# EAGLE schematic SL869-GL868-Rx (EAGLE 6.5.0)
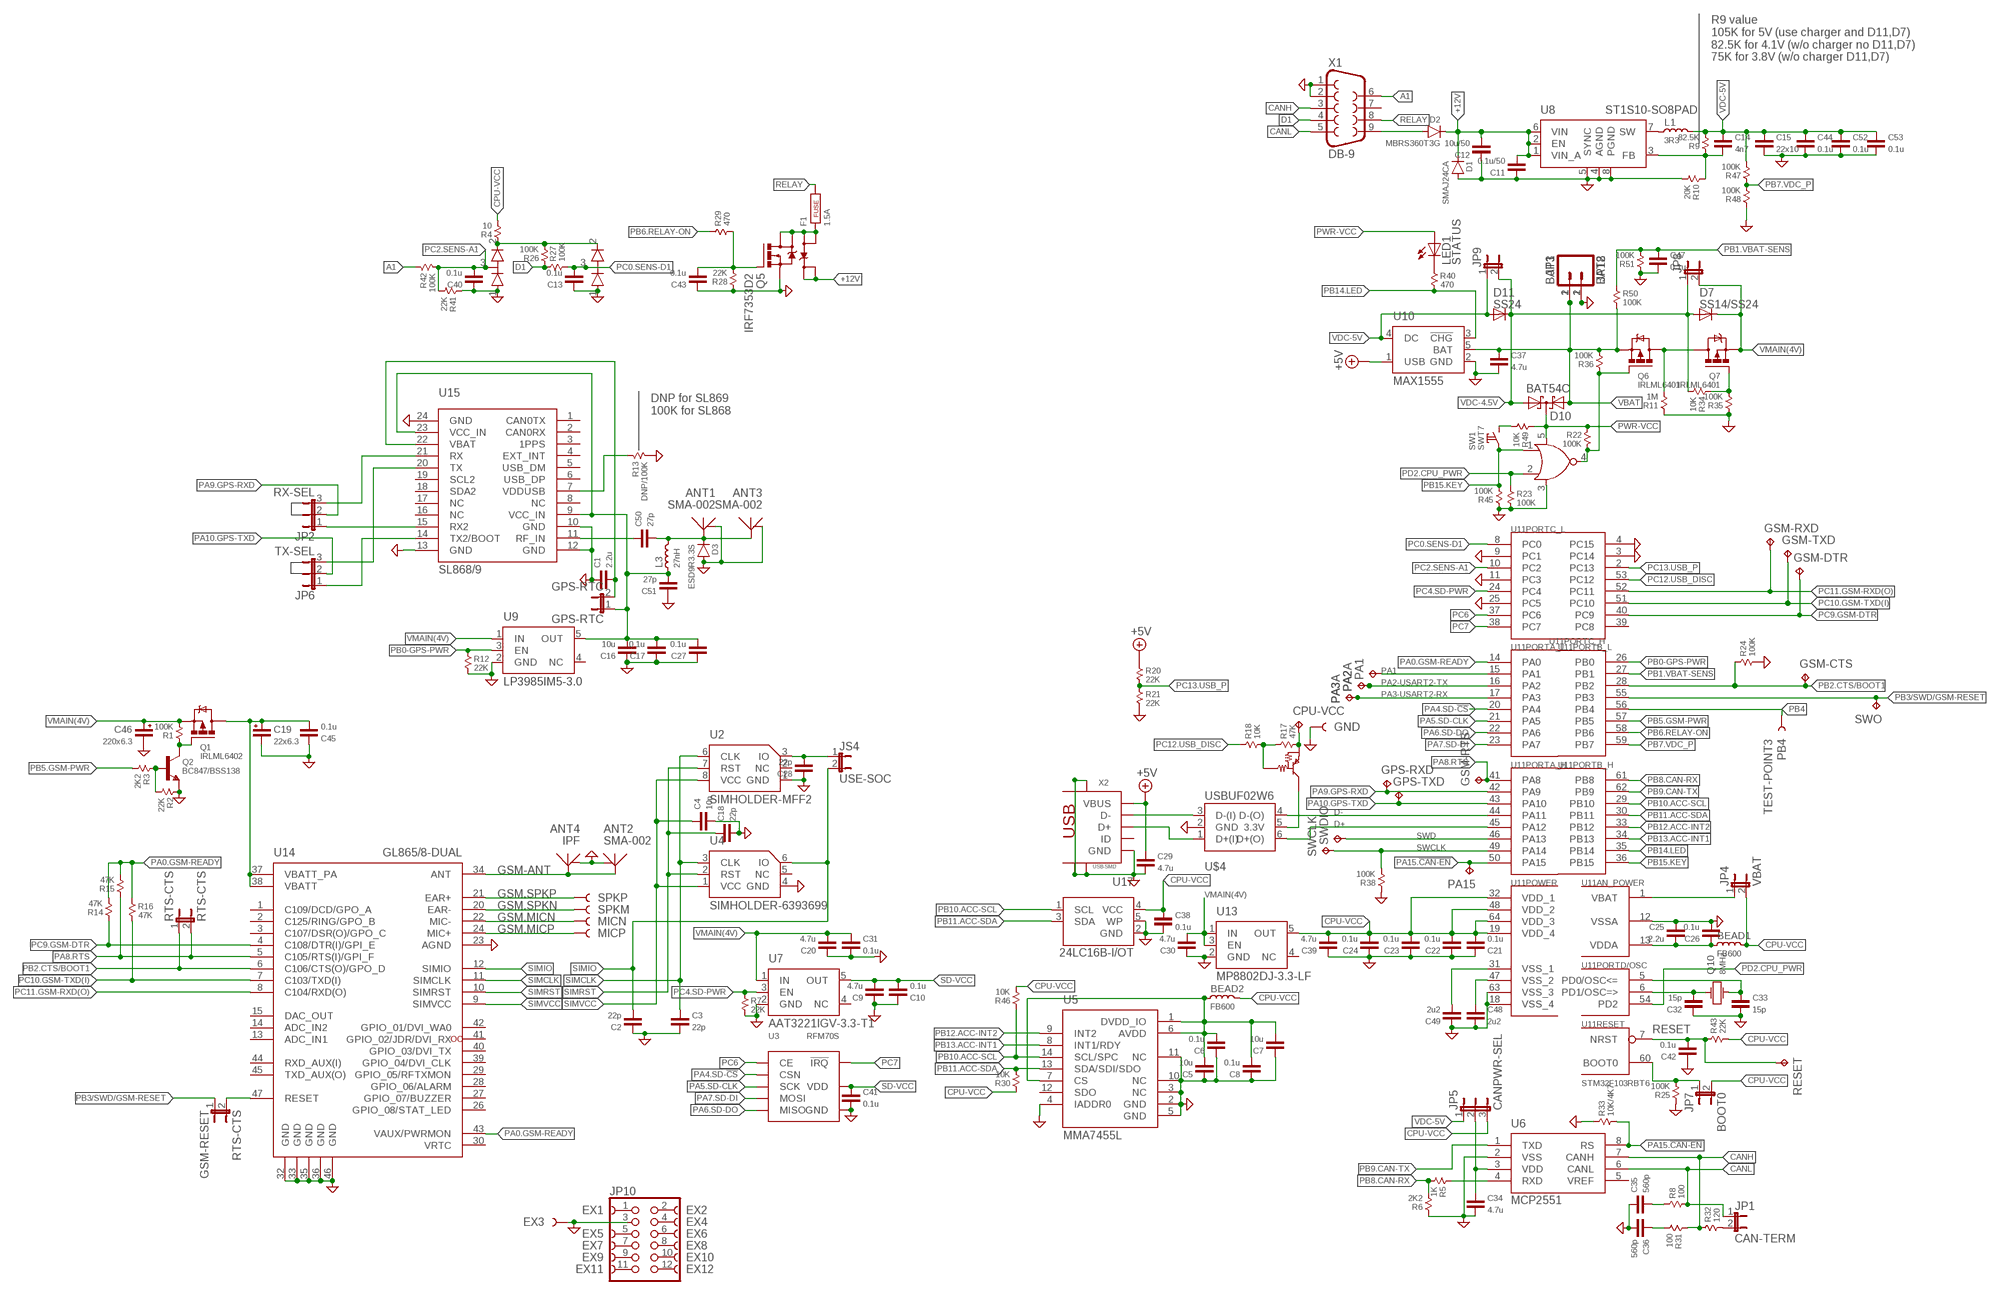
[diagram p0: schematic, sheet 1]

## Parts
ANT1  SMA-002  ANTENNA-SMA-002  [SMA-002]
ANT2  SMA-002  ANTENNA-SMA-002  [SMA-002]
ANT3  SMA-002  ANTENNA-IPF  [MM9329]
ANT4  IPF  ANTENNA-IPF  [MM9329]
BEAD1  FB600  INDUCTOR-0603  [0603]
BEAD2  FB600  INDUCTOR-0603  [0603]
C1  2.2u  CAP-0603  [0603]
C2  22p  CAP-0603  [0603]
C3  22p  CAP-0603  [0603]
C4  10n  CAP-0603  [0603]
C5  10u  CAP-0603  [0603]
C6  0.1u  CAP-0603  [0603]
C7  10u  CAP-0603  [0603]
C8  0.1u  CAP-0603  [0603]
C9  4.7u  CAP-0603  [0603]
C10  0.1u  CAP-0603  [0603]
C11  0.1u/50  CAP-0603  [0603]
C12  10u/50  CAP-1206  [1206]
C13  0.1u  CAP-0603  [0603]
C14  4n7  CAP-0603  [0603]
C15  22x10  CAP-1206  [1206]
C16  10u  CAP-0603  [0603]
C17  0.1u  CAP-0603  [0603]
C18  22p  CAP-0603  [0603]
C19  22x6.3  CAP-POL-3528  [CT3528]
C20  4.7u  CAP-0603  [0603]
C21  0.1u  CAP-0603  [0603]
C22  0.1u  CAP-0603  [0603]
C23  0.1u  CAP-0603  [0603]
C24  0.1u  CAP-0603  [0603]
C25  2.2u  CAP-0603  [0603]
C26  0.1u  CAP-0603  [0603]
C27  0.1u  CAP-0603  [0603]
C28  22p  CAP-0603  [0603]
C29  4.7u  CAP-0603  [0603]
C30  4.7u  CAP-0603  [0603]
C31  0.1u  CAP-0603  [0603]
C32  15p  CAP-0603  [0603]
C33  15p  CAP-0603  [0603]
C34  4.7u  CAP-0603  [0603]
C35  560p  CAP-0603  [0603]
C36  560p  CAP-0603  [0603]
C37  4.7u  CAP-0603  [0603]
C38  0.1u  CAP-0603  [0603]
C39  4.7u  CAP-0603  [0603]
C40  0.1u  CAP-0603  [0603]
C41  0.1u  CAP-0603  [0603]
C42  0.1u  CAP-0603  [0603]
C43  0.1u  CAP-0603  [0603]
C44  0.1u  CAP-0603  [0603]
C45  0.1u  CAP-0603  [0603]
C46  220x6.3  CAP-POL-7343  [CT7343]
C47  0.1u  CAP-0603  [0603]
C48  2u2  CAP-0603  [0603]
C49  2u2  CAP-0603  [0603]
C50  27p  CAP-0603  [0603]
C51  27p  CAP-0603  [0603]
C52  0.1u  CAP-0603  [0603]
C53  0.1u  CAP-0603  [0603]
CPU-VCC  TPTP09R  [TP09R]
D1  SMAJ24CA  DIODE-SMA  [SMA]
D2  MBRS360T3G  DIODE-SMC  [SMC]
D3  ESD9R3.3S  DIODE-ESD9  [SOD-923]
D4  BAV99  [SOT-23]
D7  SS14/SS24  DIODESMA  [SMA-DIODE]
D10  BAT54C  [SOT23]
D11  SS24  DIODESMA  [SMA-DIODE]
D14  BAV99  [SOT-23]
EX1  TEST-POINT1  [PAD.1X1]
EX2  TEST-POINT1  [PAD.1X1]
EX3  TEST-POINT1  [PAD.1X1]
EX4  TEST-POINT1  [PAD.1X1]
EX5  TEST-POINT1  [PAD.1X1]
EX6  TEST-POINT1  [PAD.1X1]
EX7  TEST-POINT1  [PAD.1X1]
EX8  TEST-POINT1  [PAD.1X1]
EX9  TEST-POINT1  [PAD.1X1]
EX10  TEST-POINT1  [PAD.1X1]
EX11  TEST-POINT1  [PAD.1X1]
EX12  TEST-POINT1  [PAD.1X1]
F1  1.5A  FUSE  [1812]
GND  TEST-POINT3  [PAD.03X.03]
GPS-RTC  GPS-RTC  JUMPER-2SMD-NO  [SJ_2S-NO]
GPS-RXD  TPTP07R  [TP07R]
GPS-TXD  TPTP07R  [TP07R]
GSM-CTS  TPTP07R  [TP07R]
GSM-DTR  TPTP07R  [TP07R]
GSM-RESET  RTS-CTS  JUMPER-2SMD-NO  [SJ_2S-NO]
GSM-RTS  TPTP07R  [TP07R]
GSM-RXD  TPTP07R  [TP07R]
GSM-TXD  TPTP07R  [TP07R]
JP1  CAN-TERM  JUMPER-2SMD-NO  [SJ_2S-NO]
JP2  RX-SEL  JUMPER-3SMD  [SJ_3]
JP3  BAT2  M02-JST-2MM-SMT  [S2B-PH]
JP4  VBAT  JUMPER-2SMD-NO  [SJ_2S-NO]
JP5  CANPWR-SEL  JUMPER-3SMD  [SJ_3]
JP6  TX-SEL  JUMPER-3SMD  [SJ_3]
JP7  BOOT0  JUMPER-2SMD-NO  [SJ_2S-NO]
JP8  JUMPER-2SMD-NO  [SJ_2S-NO]
JP9  JUMPER-2SMD-NO  [SJ_2S-NO]
JP10  PINHD-2X6  [2X06]
JP18  BAT1  M02-CI1102M1H  [CI1102M1H]
JS4  USE-SOC  JUMPER-2SMD-NO  [SJ_2S-NO]
L1  3R3  INDUCTOR-CDRH6D38NP  [CDRH6D38NP]
L3  27nH  INDUCTOR-0603  [0603]
LED1  STATUS  LED3MM  [LED3MM]
MICN  TEST-POINT1  [PAD.1X1]
MICP  TEST-POINT1  [PAD.1X1]
PA1  TPTP08R  [TP08R]
PA2  TPTP08R  [TP08R]
PA2A  TPTP07R  [TP07R]
PA3  TPTP08R  [TP08R]
PA3A  TPTP07R  [TP07R]
PA15  TPTP07R  [TP07R]
PB4  TEST-POINT3  [PAD.03X.03]
Q1  IRLML6402  [SOT-23]
Q2  BC847/BSS138  NPNBC847  [SOT-23]
Q5  IRF7353D2  [SO08]
Q6  IRLML6401  [SOT-23]
Q7  IRLML6401  [SOT-23]
Q10  8MHz  CRYSTAL-KX-9A  [KX-9A]
R1  100K  RESISTOR-0603  [0603]
R2  22K  RESISTOR-0603  [0603]
R3  2K2  RESISTOR-0603  [0603]
R4  10  RESISTOR-0603  [0603]
R5  1K  RESISTOR-0603  [0603]
R6  2K2  RESISTOR-0603  [0603]
R7  22K  RESISTOR-0603  [0603]
R8  100  RESISTOR-0603  [0603]
R9  82.5K  RESISTOR-0603  [0603]
R10  20K  RESISTOR-0603  [0603]
R11  1M  RESISTOR-0603  [0603]
R12  22K  RESISTOR-0603  [0603]
R13  DNP/100K  RESISTOR-0603  [0603]
R14  47K  RESISTOR-0603  [0603]
R15  47K  RESISTOR-0603  [0603]
R16  47K  RESISTOR-0603  [0603]
R17  47K  RESISTOR-0603  [0603]
R18  10K  RESISTOR-0603  [0603]
R20  22K  RESISTOR-0603  [0603]
R21  22K  RESISTOR-0603  [0603]
R22  100K  RESISTOR-0603  [0603]
R23  100K  RESISTOR-0603  [0603]
R24  100K  RESISTOR-0603  [0603]
R25  100K  RESISTOR-0603  [0603]
R26  100K  RESISTOR-0603  [0603]
R27  100K  RESISTOR-0603  [0603]
R28  22K  RESISTOR-0603  [0603]
R29  470  RESISTOR-0603  [0603]
R30  10K  RESISTOR-0603  [0603]
R31  100  RESISTOR-0603  [0603]
R32  120  RESISTOR-0603  [0603]
R33  10K/4K7  RESISTOR-0603  [0603]
R34  10K  RESISTOR-0603  [0603]
R35  100K  RESISTOR-0603  [0603]
R36  100K  RESISTOR-0603  [0603]
R38  100K  RESISTOR-0603  [0603]
R40  470  RESISTOR-0603  [0603]
R41  22K  RESISTOR-0603  [0603]
R42  100K  RESISTOR-0603  [0603]
R43  22K  RESISTOR-0603  [0603]
R45  100K  RESISTOR-0603  [0603]
R46  10K  RESISTOR-0603  [0603]
R47  100K  RESISTOR-0603  [0603]
R48  100K  RESISTOR-0603  [0603]
R49  10K  RESISTOR-0603  [0603]
R50  100K  RESISTOR-0603  [0603]
R51  100K  RESISTOR-0603  [0603]
RESET  TPTP09R  [TP09R]
RTS-CTS  RTS-CTS  JUMPER-2SMD-NO  [SJ_2S-NO]
SPKM  TEST-POINT1  [PAD.1X1]
SPKP  TEST-POINT1  [PAD.1X1]
SW1  SWT7  SWITCH-2-SWT7  [SWT-7]
SWCLK  TPTP09R  [TP09R]
SWDIO  TPTP09R  [TP09R]
SWO  TPTP07R  [TP07R]
U1  74LVC1G02GV  [SOT-753]
U2  SIMHOLDER-MFF2  [MFF2]
U3  RFM70S  [RFM70S]
U4  SIMHOLDER-6393699  [6393699-1]
U5  MMA7455L  [LGA14]
U6  MCP2551  [SO08]
U7  AAT3221IGV-3.3-T1  TPS73033  [SOT23-5]
U8  ST1S10-SO8PAD  [SO08-EPAD]
U9  LP3985IM5-3.0  TPS73033  [SOT23-5]
U10  MAX1555  [SOT23-5]
U11  STM32F103RBT6  STM32F10XRXT6  [TQFP64]
U13  MP8802DJ-3.3-LF  TPS73033  [SOT23-5]
U14  GL865/8-DUAL  [GL865/8-DUAL]
U15  SL868/9  [SL868/9]
U17  24LC16B-I/OT  24LC01B-SOT23  [SOT23-5]
U$3  PDTA114ET  [SOT-23]
U$4  USBUF02W6  [SOT323-6]
X1  DB-9  DB9  [DB9]
X2  USB-SMD  [USB-MINIB]

## Nets
+5V: C29.2 R20.1 U10.1(USB) X2.VBUS
+12-IN: D2.P$2(A) X1.9
+12V: C11.1 C12.1 D1.P$1(C) D2.P$1(C) Q5.7(K) Q5.8(K) U8.1(VIN_A) U8.2(EN) U8.6(VIN)
A1: R42.1 X1.6
ACC-VCC: BEAD2.1 C5.1 C6.1 C7.1 C8.1 U5.1(DVDD_IO) U5.6(AVDD) U5.7(CS)
CANH: R31.1 R32.1 U6.7(CANH) X1.3
CANL: JP1.1 R8.2 U6.6(CANL) X1.5
CPU-VBAT: JP4.1 U11.1(AN_POWER:VBAT)
CPU-VCC: BEAD1.2 BEAD2.2 C21.1 C22.1 C23.1 C24.1 C38.2 C39.1 CPU-VCC.TP JP4.2 JP5.3 JP7.2 R4.2 R17.2 R30.1 R43.2 R46.2 U11.19(POWER:VDD_4) U11.32(POWER:VDD_1) U11.48(POWER:VDD_2) U11.64(POWER:VDD_3) U13.5(OUT) U17.4(VCC) U$3.2
D1: R26.1 R27.1 X1.4
D+: U11.45(PORTA_H:PA12) U$4.6(D+(O))
D-: U11.44(PORTA_H:PA11) U$4.4(D-(O))
GND: ANT1.GND@1(GND) ANT2.GND@1(GND) ANT3.2(GND) ANT4.2(GND) C1.2 C2.2 C3.1 C4.1 C5.2 C6.2 C7.2 C8.2 C9.2 C10.2 C11.2 C12.2 C13.2 C15.1 C16.2 C17.2 C18.1 C19.- C20.2 C21.2 C22.2 C23.2 C24.2 C25.2 C26.1 C27.2 C28.2 C29.1 C30.2 C31.1 C32.2 C33.1 C34.1 C35.2 C36.1 C37.1 C38.1 C39.2 C40.2 C41.1 C42.2 C43.2 C44.1 C45.2 C46.- C47.1 C48.1 C49.2 C51.2 C52.1 C53.1 D1.P$2(A) D3.2(A) D4.1(-) D14.1(-) EX3.P$1 GND.P$1 JP3.1 JP10.3 JP18.2 Q2.2(E) Q5.3(S) R2.1 R6.1 R7.2 R10.2 R11.1 R12.2 R13.2 R21.2 R23.2 R24.2 R25.1 R28.1 R33.1 R35.1 R38.1 R41.1 R45.1 R48.1 R51.1 U1.3(GND) U2.1(GND) U3.GND U4.4(GND) U5.2(GND) U5.3(NC) U5.4(IADDR0) U5.5(GND) U5.10(NC) U5.11(NC) U6.2(VSS) U7.2(GND) U8.4(AGND) U8.5(SYNC) U8.8(PGND) U9.2(GND) U10.2(GND) U11.3(PORTC_H:PC14) U11.4(PORTC_H:PC15) U11.9(PORTC_L:PC1) U11.11(PORTC_L:PC3) U11.12(AN_POWER:VSSA) U11.18(POWER:VSS_4) U11.25(PORTC_L:PC5) U11.63(POWER:VSS_3) U13.2(GND) U14.23(AGND) U14.32(GND) U14.33(GND) U14.35(GND) U14.36(GND) U14.46(GND) U15.10(GND) U15.12(GND) U15.13(GND) U15.24(GND) U17.2(GND) U17.5(WP) U$4.2(GND) X1.1 X1.2 X2.GND X2.GND@1(GND) X2.GND@2(GND) X2.GND@3(GND) X2.GND@4(GND)
GPS-RX0: JP2.1 U15.15(RX2)
GPS-RX1: JP2.3 U15.21(RX)
GPS-TX0: JP6.1 U15.14(TX2/BOOT)
GPS-TX1: JP6.3 U15.20(TX)
GPS-VCC: C16.1 C17.1 C27.1 C51.1 GPS-RTC.1 L3.1 U9.5(OUT) U15.9(VCC_IN) U15.23(VCC_IN)
GSM-ANT: ANT2.A(ANT) ANT4.1(ANT) U14.34(ANT)
GSM-RESET: GSM-RESET.2 U14.47(RESET)
GSM-VCC: C19.+ C45.1 Q1.3(D) U14.37(VBATT_PA) U14.38(VBATT)
GSM.MICN: MICN.P$1 U14.22(MIC-)
GSM.MICP: MICP.P$1 U14.24(MIC+)
GSM.SPKN: SPKM.P$1 U14.20(EAR-)
GSM.SPKP: SPKP.P$1 U14.21(EAR+)
N$1: JP1.2 R32.2
N$3: U$3.3 U$4.5(3.3V)
N$4: C1.1 GPS-RTC.2 U15.22(VBAT)
N$5: Q7.1(G) R34.1 R35.2
N$6: F1.1 Q5.1(A) Q5.2(A) Q5.5(D) Q5.6(D)
N$7: Q1.1(G) Q2.3(C) R1.1
N$8: C49.1 U11.31(POWER:VSS_1)
N$9: C48.2 U11.47(POWER:VSS_2)
N$10: C28.1 JS4.1 U2.3(IO)
N$11: C50.2 U15.11(RF_IN)
N$12: Q2.1(B) R2.2 R3.1
N$13: L1.P$1 U8.7(SW)
N$14: C35.1 R8.1
N$15: C36.2 R31.2
N$16: R13.1 U15.7(VDDUSB)
N$18: LED1.K(C) R40.1
N$19: R5.1 U6.4(RXD)
N$21: C34.2 JP5.2 U6.3(VDD)
N$22: EX1.P$1 JP10.1
N$23: EX2.P$1 JP10.2
N$25: EX4.P$1 JP10.4
N$26: C32.1 Q10.1 U11.6(PORTD/OSC:PD1/OSC=>)
N$27: EX5.P$1 JP10.5
N$28: JP7.1 R25.2 U11.60(RESET:BOOT0)
N$29: C14.1 R9.1 R10.1 U8.3(FB)
N$30: EX6.P$1 JP10.6
N$31: EX7.P$1 JP10.7
N$32: EX8.P$1 JP10.8
N$33: EX9.P$1 JP10.9
N$34: EX10.P$1 JP10.10
N$35: ANT1.A(ANT) ANT3.1(ANT) C50.1 D3.1(C) L3.2
N$36: EX11.P$1 JP10.11
N$37: EX12.P$1 JP10.12
N$38: R49.2 SW1.2
N$43: Q6.3(D) Q7.3(D) R11.2
N$51: C43.1 Q5.4(G) R28.2 R29.2
N$52: U$4.3(D-(I)) X2.D-
N$53: U$4.1(D+(I)) X2.D+
N$54: C33.2 Q10.3 U11.5(PORTD/OSC:PD0/OSC<=)
N$999: R17.1 R18.2 U$3.1
PA0.GSM-READY: R14.2 R15.2 R16.1 U11.14(PORTA_L:PA0) U14.43(VAUX/PWRMON)
PA1: PA1.TP U11.15(PORTA_L:PA1)
PA2-USART2-TX: PA2.TP PA2A.TP U11.16(PORTA_L:PA2)
PA3-USART2-RX: PA3.TP PA3A.TP U11.17(PORTA_L:PA3)
PA4.SD-!CS: U3.CSN U11.20(PORTA_L:PA4)
PA5.SD-CLK: U3.SCK U11.21(PORTA_L:PA5)
PA6.SD-DO: U3.MISO U11.22(PORTA_L:PA6)
PA7.SD-DI: U3.MOSI U11.23(PORTA_L:PA7)
PA8.RTS: GSM-RTS.TP R15.1 RTS-CTS.2 U11.41(PORTA_H:PA8) U14.5(C105/RTS(I)/GPI_F)
PA9.GPS-RXD: GPS-RXD.TP JP2.2 U11.42(PORTA_H:PA9)
PA10.GPS-TXD: GPS-TXD.TP JP6.2 U11.43(PORTA_H:PA10)
PA15.!CAN-EN: PA15.TP R33.2 U6.8(RS) U11.50(PORTA_H:PA15)
PB0-GPS-PWR: R12.1 U9.3(EN) U11.26(PORTB_L:PB0)
PB1.VBAT-SENS: C47.2 R50.1 R51.2 U11.27(PORTB_L:PB1)
PB2.CTS/BOOT1: GSM-CTS.TP R24.1 RTS-CTS.1 U11.28(PORTB_L:PB2) U14.6(C106/CTS(O)/GPO_D)
PB3/SWD/GSM-RESET: GSM-RESET.1 SWO.TP U11.55(PORTB_L:PB3)
PB4: PB4.P$1 U11.56(PORTB_L:PB4)
PB5.GSM-PWR: R3.2 U11.57(PORTB_L:PB5)
PB6.RELAY-ON: R29.1 U11.58(PORTB_L:PB6)
PB7.VDC_P: R47.1 R48.2 U11.59(PORTB_L:PB7)
PB8.CAN-RX: R5.2 R6.2 U11.61(PORTB_H:PB8)
PB9.CAN-TX: U6.1(TXD) U11.62(PORTB_H:PB9)
PB10.ACC-SCL: R46.1 U5.14(SCL/SPC) U11.29(PORTB_H:PB10) U17.1(SCL)
PB11.ACC-SDA: R30.2 U5.13(SDA/SDI/SDO) U11.30(PORTB_H:PB11) U17.3(SDA)
PB12.ACC-INT2: U5.9(INT2) U11.33(PORTB_H:PB12)
PB13.ACC-INT1: U5.8(INT1/RDY) U11.34(PORTB_H:PB13)
PB14.LED: R40.2 U10.3(!CHG) U11.35(PORTB_H:PB14)
PB15.KEY: R45.2 SW1.1 U1.1(A) U11.36(PORTB_H:PB15)
PC0.SENS-D1: C13.1 D4.3(S) R27.2 U11.8(PORTC_L:PC0)
PC2.SENS-A1: C40.1 D14.3(S) R41.2 R42.2 U11.10(PORTC_L:PC2)
PC4.SD-PWR: R7.1 U7.3(EN) U11.24(PORTC_L:PC4)
PC6: U3.CE U11.37(PORTC_L:PC6)
PC7: U3.IRQ(!IRQ) U11.38(PORTC_L:PC7)
PC9.GSM-DTR: GSM-DTR.TP R14.1 U11.40(PORTC_H:PC9) U14.4(C108/DTR(I)/GPI_E)
PC10.GSM-TXD(I): GSM-TXD.TP R16.2 U11.51(PORTC_H:PC10) U14.7(C103/TXD(I))
PC11.GSM-RXD(O): GSM-RXD.TP U11.52(PORTC_H:PC11) U14.8(C104/RXD(O))
PC12.USB_DISC: R18.1 U11.53(PORTC_H:PC12)
PC13.USB_P: R20.2 R21.1 U11.2(PORTC_H:PC13)
PD2.CPU_PWR: R23.1 U1.2(B) U11.54(PORTD/OSC:PD2)
PWR-VCC: D10.3(CC) LED1.A R22.1 R49.1 U1.5(VCC)
RELAY: F1.2 X1.8
RESET: C42.1 R43.1 RESET.TP U11.7(RESET:NRST)
SD-VCC: C9.1 C10.1 C41.2 U3.VDD U7.5(OUT)
SENS-VCC: D4.2(+) D14.2(+) R4.1 R26.2
SIMCLK: C3.2 U2.6(CLK) U4.3(CLK) U14.11(SIMCLK)
SIMIO: C2.1 JS4.2 U4.6(IO) U14.12(SIMIO)
SIMRST: C18.2 U2.7(RST) U4.2(RST) U14.10(SIMRST)
SIMVCC: C4.2 U2.8(VCC) U4.1(VCC) U14.9(SIMVCC)
SWCLK: R38.2 SWCLK.TP U11.49(PORTA_H:PA14)
SWD: SWDIO.TP U11.46(PORTA_H:PA13)
VBAT: C37.2 D10.2(A2) JP3.2 JP18.1 Q6.2(S) R36.2 R50.2 U10.5(BAT)
VDC-4.5V: D7.A D10.1(A1) D11.C JP8.1 JP9.2 R34.2
VDC-5V: C14.2 C15.2 C44.2 C52.2 C53.2 D11.A JP5.1 JP9.1 L1.P$2 R9.2 R47.2 U10.4(DC)
VDDA: BEAD1.1 C25.1 C26.2 U11.13(AN_POWER:VDDA)
VE: Q6.1(G) R22.2 R36.1 U1.4(Y)
VMAIN(4V): C20.1 C30.1 C31.2 C46.+ D7.C JP8.2 Q1.2(S) Q7.2(S) R1.2 U7.1(IN) U9.1(IN) U13.1(IN) U13.3(EN)
Unconnected: U2.2(NC) U4.5(NC) U5.12(SDO) U6.5(VREF) U7.4(NC) U9.4(NC) U11.39(PORTC_H:PC8) U13.4(NC) U14.1(C109/DCD/GPO_A) U14.2(C125/RING/GPO_B) U14.3(C107/DSR(O)/GPO_C) U14.13(ADC_IN1) U14.14(ADC_IN2) U14.15(DAC_OUT) U14.26(GPIO_08/STAT_LED) U14.27(GPIO_07/BUZZER) U14.28(GPIO_06/ALARM) U14.29(GPIO_05/RFTXMON) U14.30(VRTC) U14.39(GPIO_04/DVI_CLK) U14.40(GPIO_03/DVI_TX) U14.41(GPIO_02/JDR/DVI_RX) U14.42(GPIO_01/DVI_WA0) U14.44(RXD_AUX(I)) U14.45(TXD_AUX(O)) U15.1(CAN0TX) U15.2(CAN0RX) U15.3(1PPS) U15.4(EXT_INT) U15.5(USB_DM) U15.6(USB_DP) U15.8(NC) U15.16(NC) U15.17(NC) U15.18(SDA2) U15.19(SCL2) X1.7 X2.ID

## Notes on the sheet
- R9 value
  105K for 5V (use charger and D11,D7)
  82.5K for 4.1V (w/o charger no D11,D7)
  75K for 3.8V (w/o charger D11,D7)
- DNP for SL869
  100K for SL868

## Library data of the parts
ANT1-ANT4 = X893:ANTENNA: Antennes
BEAD1 BEAD2 L1 L3 = X893:INDUCTOR: http://www.murata.com/products/catalog/pdf/o05e.pdf
C1-C18 C20-C45 C47-C53 = X893:CAP: Capacitor
C19 C46 = X893:CAP-POL
CPU-VCC GPS-RXD GPS-TXD GSM-CTS GSM-DTR GSM-RTS GSM-RXD GSM-TXD PA1 PA2 PA2A PA3 PA3A PA15 RESET SWCLK SWDIO SWO = testpad:TP: Test pad
D1-D3 = X893:DIODE
D4 D14 = X893:BAV99: http://www.terraelectronica.ru/pdf/NXP/BAV99.pdf
D7 D11 = SparkFun:DIODE: Diode These are standard reverse protection diodes and small signal diodes. SMA package can handle up to about 1A. SOD-323 can handle about 200mA. What the SOD-323 package when ordering, there are some mfgs out there that are 5-pin packages.
D10 = diode:BAT54C: Schottky Diodes Source: Fairchild .. BAT54.pdf
EX1-EX12 GND MICN MICP PB4 SPKM SPKP = SparkFun:TEST-POINT
F1 = X893:FUSE: http://smd.ru/files/upload/1236/ru/smd1812.pdf
GPS-RTC GSM-RESET JP1 JP4 JP7-JP9 JS4 RTS-CTS = SparkFun:JUMPER-2: Jumper Basic 0.1" spaced jumper. Use with breakaway headers.
JP2 JP5 JP6 = SparkFun:JUMPER-3
JP3 = SparkFun:M02: Header 2 Standard 2-pin 0.1" header. Use with straight break away headers (SKU : PRT-00116), right angle break away headers (PRT-00553), swiss pins (PRT-00743), machine pins (PRT-00117), and female headers (PRT-00115). Molex polarized connector foot print use with SKU : PRT-08233 with associated crimp pins and housings.
JP10 = pinhead:PINHD-2X6: PIN HEADER
JP18 = X893:M02: Header 2 Standard 2-pin 0.1" header. Use with straight break away headers (SKU : PRT-00116), right angle break away headers (PRT-00553), swiss pins (PRT-00743), machine pins (PRT-00117), and female headers (PRT-00115). Molex polarized connector foot print use with SKU : PRT-08233 with associated crimp pins and housings.
LED1 = SparkFun:LED: LEDs Standard schematic elements and footprints for 5mm, 3mm, 1206, and 0603 sized LEDs. 5mm - Spark Fun Electronics SKU : COM-00529 (and others)
Q1 Q6 Q7 = X893:IRLML640: http://www.terraelectronica.ru/pdf/IR/IRLML6401.pdf http://www.terraelectronica.ru/pdf/IR/IRLML6402.pdf
Q2 = X893:NPN
Q5 = X893:IRF7353D2: http://www.irf.com/product-info/datasheets/data/irf7353d2.pdf
Q10 = X893:CRYSTAL: Crystal
R1-R18 R20-R36 R38 R40-R43 R45-R51 = X893:RESISTOR
SW1 = X893:SWITCH-2: KSR http://www.farnell.com/datasheets/320571.pdf
U1 = X893:74LVC1G02G
U2 U4 = X893:SIMHOLDER: SIM Holder
U3 = X893:RFM70S: http://www.terraelectronica.ru/pdf/HOPERF/RFM70.pdf
U5 = X893:MMA7455L: http://www.terraelectronica.ru/pdf/FRS/MMA7455L.pdf
U6 = SparkFun:MCP2551
U7 U9 U13 = X893:TPS73033: LOW-NOISE, HIGH PSRR, RF 200-mA LOW-DROPOUT LINEAR REGULATOR http://www.terraelectronica.ru/pdf/TI/TPS73033.pdf
U8 = X893:ST1S10: 3 A, 900 kHz, monolithic synchronous step-down regulator http://www.terraelectronica.ru/pdf/ST/ST1S10.pdf
U10 = X893:MAX1555
U11 = stm32:STM32F10XRXT6: STM32F101/103 64pin LQFP
U14 = X893:GL865/8-DUAL
U15 = X893:SL868/9
U17 = X893:24LC01B: http://ww1.microchip.com/downloads/en/DeviceDoc/21711J.pdf
U$3 = X893:PDTA114E: http://www.nxp.com/documents/data_sheet/PDTA114E_SER.pdf
U$4 = X893:USBUF02W6
X1 = SparkFun:DB9: DB9 Connector Standard DB9 (D-Sub 9) serial connector. Can be used for CAN bus as well as RS485 and RS232. Footprint production proven. Spark Fun Electronics SKU : PRT-00429
X2 = X893:USB: USB Connectors USB-B-PTH is fully proven SKU : PRT-00139 USB-miniB is fully proven SKU : PRT-00587 USB-A-PCB is untested. USB-A-H is throughly reviewed, but untested. Spark Fun Electronics SKU : PRT-00437 USB-B-SMT is throughly reviewed, but untested. Needs silkscreen touching up. USB-A-S has not been used/tested USB-MB-H has not been used/tested